# Altium schematic sheet Sheet1_1.SchDoc: Custom_Title
size 431 x 279 mm; Date: 11.11.2011; ApprovedBy: Ivan Petrov; CheckedBy: Stepan Ivanov; Author: Nikita Vasilyev; CompanyName: Altium; DrawnBy: Nikos Safronov; Engineer: Yurii Nikulin; Organization: Facebook; Address1: CustAddress_1; Address2: CustAddress_2; Address3: CustAddress_3; Address4: CustAddress_4; DocumentNumber: 123; Revision: 1; SheetNumber: 1; SheetTotal: 2; ENG_APP_DATE: --/--/--; DSN_APP_DATE: --/--/--; CHK_APP_DATE: --/--/--; Time: 17:07:07; ImagePath: /image_Path/1
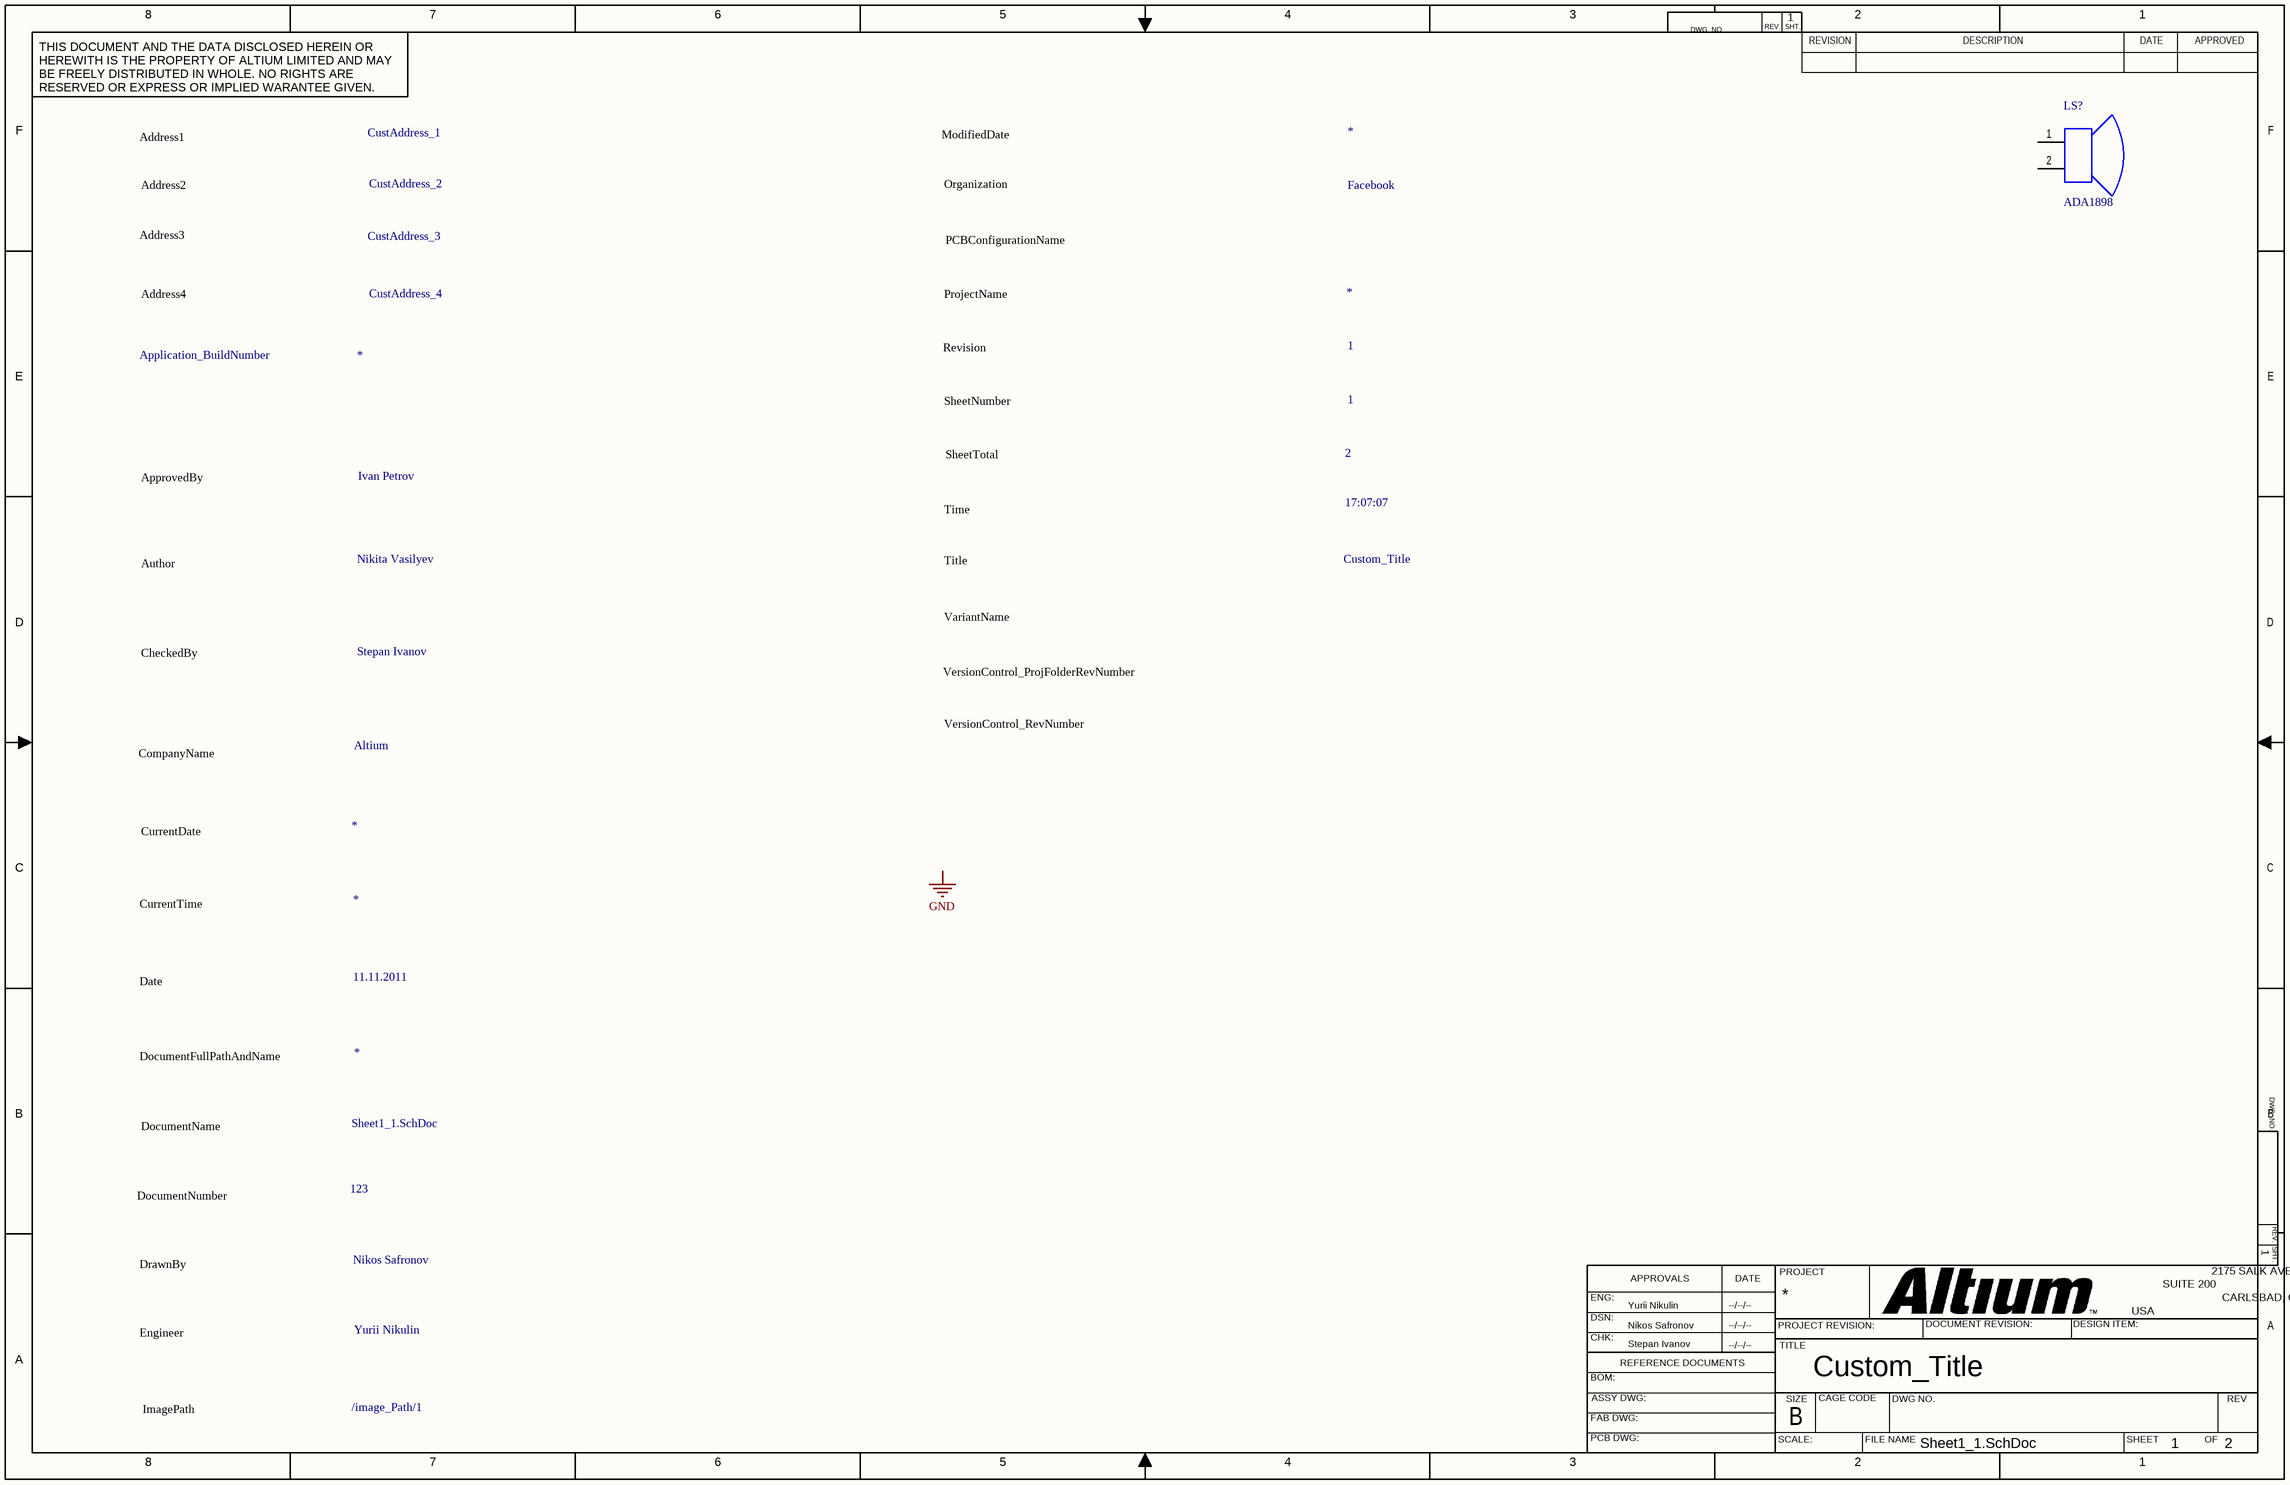
[diagram p0: Sheet1_1.SchDoc]

## Parts
LS?  ADA1898  [ADAI-ADA1898]

## Nets

Not connected (* = marked no-connect by the designer): LS? 1(+) 2(-)

## Notes on the sheet
- Address1
- ModifiedDate
- Address2
- Organization
- Address3
- Address4
- ProjectName
- PCBConfigurationName
- Application_BuildNumber
- Revision
- SheetNumber
- ApprovedBy
- SheetTotal
- Author
- Time
- Title
- VariantName
- CheckedBy
- VersionControl_ProjFolderRevNumber
- CompanyName
- VersionControl_RevNumber
- CurrentDate
- CurrentTime
- Date
- DocumentFullPathAndName
- DocumentName
- DocumentNumber
- DrawnBy
- Engineer
- ImagePath
- Labels drawn without touching a wire or pin: GND
- 8
- 7
- 6
- 5
- 4
- 3
- DWG. NO.
- REV.
- SHT.
- 2
- 1
- THIS DOCUMENT AND THE DATA DISCLOSED HEREIN OR HEREWITH IS THE PROPERTY OF ALTIUM LIMITED AND MAY BE FREELY DISTRIBUTED IN WHOLE. NO RIGHTS ARE RESERVED OR EXPRESS OR IMPLIED WARANTEE GIVEN.
- REVISION
- DESCRIPTION
- DATE
- APPROVED
- F
- E
- D
- C
- B
- ENG:
- APPROVALS
- PROJECT
- SUITE 200
- 2175 SALK AVENUE
- CARLSBAD, CA 92008
- A
- DSN:
- CHK:
- REFERENCE DOCUMENTS
- PROJECT REVISION:
- TITLE
- DOCUMENT REVISION:
- DESIGN ITEM:
- USA
- BOM:
- FAB DWG:
- PCB DWG:
- ASSY DWG:
- SCALE:
- SIZE
- CAGE CODE
- FILE NAME
- DWG NO.
- SHEET
- OF
- REV

## Library data of the parts
LS? = CMP-00027-00000-1: Mini Speaker, 8 Ohm, 0.2 Wmax, -10 to 40 degC, 2-Pin THD, RoHS; Manufacturer: Adafruit Industries; Mounting Technology: TH; Datasheet URL: https://cdn-shop.adafruit.com/datasheets/P1898.pdf; Package Description: 2-Pin Through Hole Device, Dia 29.3 mm, Pitch 15 mm; Case/Package: ADA1898; Package Reference: ADA1898; Datasheet Version: Mar-14; Manufacturer URL: https://www.adafruit.com/; RoHS Compliant: Unknown